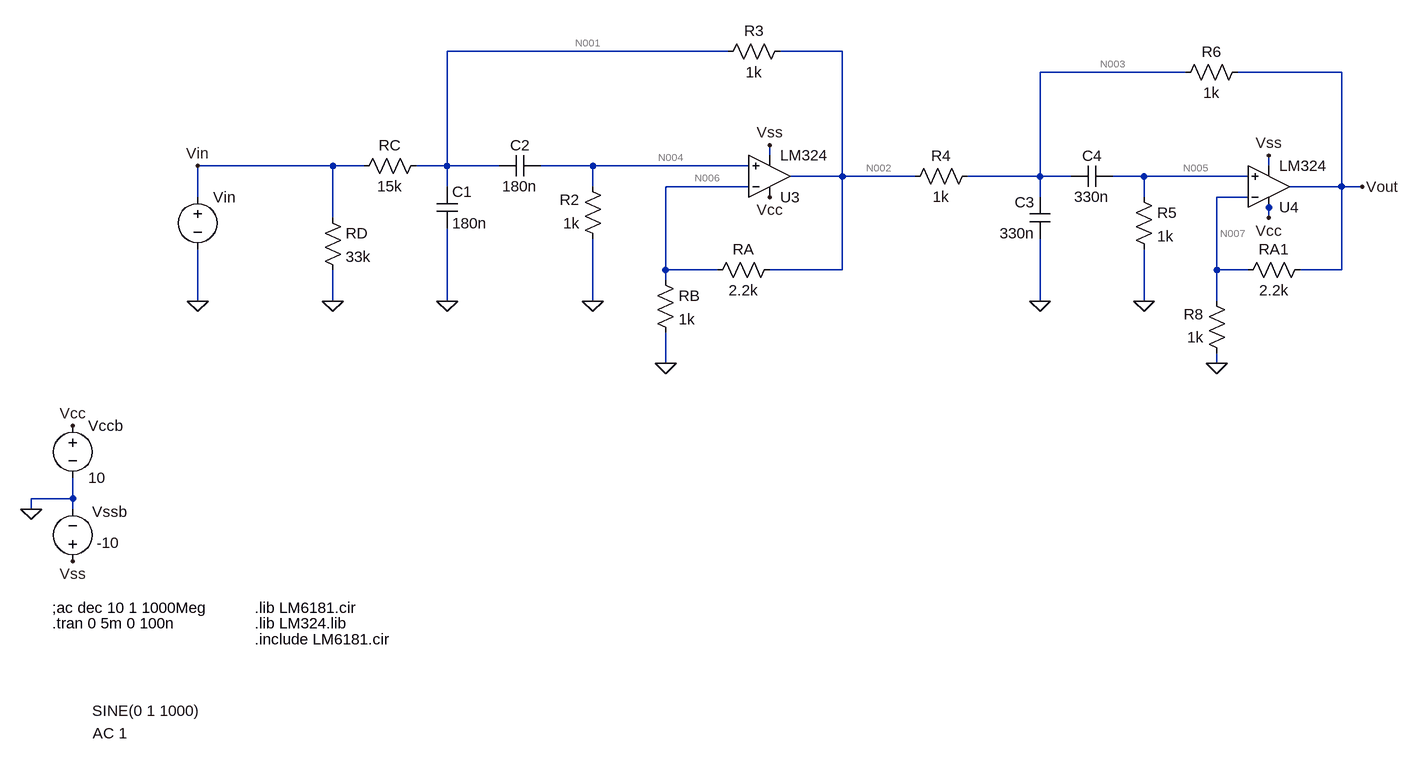
[diagram p0: schematic Lab4_Filtros Activos.asc]
Lab4_Filtros Activos.asc, the LTspice schematic file:
Version 4
SHEET 1 3612 1756
WIRE 352 -176 -80 -176
WIRE 528 -176 432 -176
WIRE 1056 -144 832 -144
WIRE 1296 -144 1136 -144
WIRE 416 -16 416 -32
WIRE -256 0 -464 0
WIRE -208 0 -256 0
WIRE -80 0 -80 -176
WIRE -80 0 -128 0
WIRE 0 0 -80 0
WIRE 144 0 64 0
WIRE 384 0 144 0
WIRE 1184 0 1184 -16
WIRE 528 16 528 -176
WIRE 528 16 448 16
WIRE 640 16 528 16
WIRE 832 16 832 -144
WIRE 832 16 720 16
WIRE 880 16 832 16
WIRE 992 16 944 16
WIRE 1152 16 992 16
WIRE -80 32 -80 0
WIRE 144 32 144 0
WIRE 384 32 256 32
WIRE 1296 32 1296 -144
WIRE 1296 32 1216 32
WIRE 1328 32 1296 32
WIRE -464 48 -464 0
WIRE 832 48 832 16
WIRE 992 48 992 16
WIRE 1152 48 1104 48
WIRE 1184 64 1184 48
WIRE -256 80 -256 0
WIRE 1184 80 1184 64
WIRE 256 160 256 32
WIRE 336 160 256 160
WIRE 528 160 528 16
WIRE 528 160 416 160
WIRE 1104 160 1104 48
WIRE 1152 160 1104 160
WIRE 1296 160 1296 32
WIRE 1296 160 1232 160
WIRE 256 176 256 160
WIRE -464 208 -464 128
WIRE -256 208 -256 160
WIRE -80 208 -80 96
WIRE 144 208 144 112
WIRE 832 208 832 112
WIRE 992 208 992 128
WIRE 1104 208 1104 160
WIRE 256 304 256 256
WIRE 1104 304 1104 288
WIRE -656 512 -656 480
WIRE -656 512 -720 512
WIRE -720 528 -720 512
WIRE -656 528 -656 512
FLAG 416 -32 Vss
FLAG 416 48 Vcc
FLAG -464 208 0
FLAG -720 528 0
FLAG -656 400 Vcc
FLAG -656 608 Vss
FLAG 1328 32 Vout
FLAG -464 0 Vin
FLAG 1184 -16 Vss
FLAG 1184 80 Vcc
FLAG -80 208 0
FLAG 144 208 0
FLAG 256 304 0
FLAG -256 208 0
FLAG 832 208 0
FLAG 1104 304 0
FLAG 992 208 0
SYMBOL voltage -464 32 R0
WINDOW 123 -161 841 Left 2
WINDOW 39 0 0 Left 0
WINDOW 3 -162 806 Left 2
SYMATTR Value2 AC 1
SYMATTR Value SINE(0 1 1000)
SYMATTR InstName Vin
SYMBOL voltage -656 384 R0
WINDOW 123 0 0 Left 0
WINDOW 39 0 0 Left 0
SYMATTR InstName Vccb
SYMATTR Value 10
SYMBOL voltage -656 624 R180
WINDOW 123 0 0 Left 0
WINDOW 39 0 0 Left 0
WINDOW 0 -83 92 Left 2
WINDOW 3 -72 44 Left 2
SYMATTR InstName Vssb
SYMATTR Value -10
SYMBOL OpAmps\\opamp2 416 80 M180
SYMATTR InstName U3
SYMATTR Value LM324
SYMBOL OpAmps\\opamp2 1184 96 M180
SYMATTR InstName U4
SYMATTR Value LM324
SYMBOL res -112 -16 R90
WINDOW 0 0 56 VBottom 2
WINDOW 3 32 56 VTop 2
SYMATTR InstName RC
SYMATTR Value 15k
SYMBOL res 160 128 R180
WINDOW 0 36 76 Left 2
WINDOW 3 36 40 Left 2
SYMATTR InstName R2
SYMATTR Value 1k
SYMBOL res 336 -160 R270
WINDOW 0 32 56 VTop 2
WINDOW 3 0 56 VBottom 2
SYMATTR InstName R3
SYMATTR Value 1k
SYMBOL res 736 0 R90
WINDOW 0 0 56 VBottom 2
WINDOW 3 32 56 VTop 2
SYMATTR InstName R4
SYMATTR Value 1k
SYMBOL res 976 32 R0
SYMATTR InstName R5
SYMATTR Value 1k
SYMBOL res 1152 -160 R90
WINDOW 0 0 56 VBottom 2
WINDOW 3 32 56 VTop 2
SYMATTR InstName R6
SYMATTR Value 1k
SYMBOL res 1248 144 R90
WINDOW 0 0 56 VBottom 2
WINDOW 3 32 56 VTop 2
SYMATTR InstName RA1
SYMATTR Value 2.2k
SYMBOL res 1120 304 R180
WINDOW 0 36 76 Left 2
WINDOW 3 36 40 Left 2
SYMATTR InstName R8
SYMATTR Value 1k
SYMBOL res 320 176 R270
WINDOW 0 32 56 VTop 2
WINDOW 3 0 56 VBottom 2
SYMATTR InstName RA
SYMATTR Value 2.2k
SYMBOL res 240 160 R0
SYMATTR InstName RB
SYMATTR Value 1k
SYMBOL cap -96 32 R0
SYMATTR InstName C1
SYMATTR Value 180n
SYMBOL cap 64 -16 R90
WINDOW 0 0 32 VBottom 2
WINDOW 3 32 32 VTop 2
SYMATTR InstName C2
SYMATTR Value 180n
SYMBOL cap 848 112 R180
WINDOW 0 24 56 Left 2
WINDOW 3 24 8 Left 2
SYMATTR InstName C3
SYMATTR Value 330n
SYMBOL cap 880 32 R270
WINDOW 0 32 32 VTop 2
WINDOW 3 0 32 VBottom 2
SYMATTR InstName C4
SYMATTR Value 330n
SYMBOL res -272 64 R0
SYMATTR InstName RD
SYMATTR Value 33k
TEXT -376 704 Left 2 !.lib LM324.lib
TEXT -688 680 Left 2 !;ac dec 10 1 1000Meg
TEXT -688 704 Left 2 !.tran 0 5m 0 100n
TEXT -376 680 Left 2 !.lib LM6181.cir
TEXT -376 728 Left 2 !.include LM6181.cir

The netlist it stands for:
* Lab4_Filtros Activos.asc
Vin Vin 0 SINE(0 1 1000) AC 1
Vccb Vcc 0 10
Vssb Vss 0 -10
XU3 N004 N006 Vcc Vss N002 LM324  ; pins In+ In- V+ V- OUT
XU4 N005 N007 Vcc Vss Vout LM324  ; pins In+ In- V+ V- OUT
RC N001 Vin 15k
R2 0 N004 1k
R3 N001 N002 1k
R4 N003 N002 1k
R5 N005 0 1k
R6 Vout N003 1k
RA1 Vout N007 2.2k
R8 0 N007 1k
RA N006 N002 2.2k
RB N006 0 1k
C1 N001 0 180n
C2 N004 N001 180n
C3 0 N003 330n
C4 N003 N005 330n
RD Vin 0 33k
.lib LM324.lib
;ac dec 10 1 1000Meg
.tran 0 5m 0 100n
.lib LM6181.cir
.include LM6181.cir
.backanno
.end

* Results of the author's LTspice run, read from the files saved beside the schematic
* Operating Point, zero values left out:
*   V(vcc) = 10 V
*   V(vss) = -10 V
*   V(n002) = -87.81 µV
*   V(n006) = -13.73 µV
*   V(n004) = 19.92 µV
*   V(vout) = -87.81 µV
*   V(n007) = -13.73 µV
*   V(n005) = 19.92 µV
*   V(n001) = -82.32 µV
*   V(n003) = -87.81 µV
*   I(Rc) = -5.488 nA
*   I(R2) = -19.92 nA
*   I(R3) = 5.488 nA
*   I(R5) = 19.92 nA
*   I(Ra1) = -33.67 nA
*   I(R8) = 13.73 nA
*   I(Ra) = 33.67 nA
*   I(Rb) = -13.73 nA
*   I(Vin) = -5.488 nA
*   I(Vccb) = -1.34 mA
*   I(Vssb) = 1.34 mA
*   Ix(u3:1) = -19.92 nA
*   Ix(u3:2) = -19.94 nA
*   Ix(u3:3) = 669.9 µA
*   Ix(u3:4) = -669.8 µA
*   Ix(u3:5) = 39.16 nA
*   Ix(u4:1) = -19.92 nA
*   Ix(u4:2) = -19.94 nA
*   Ix(u4:3) = 669.9 µA
*   Ix(u4:4) = -669.8 µA
*   Ix(u4:5) = 33.67 nA
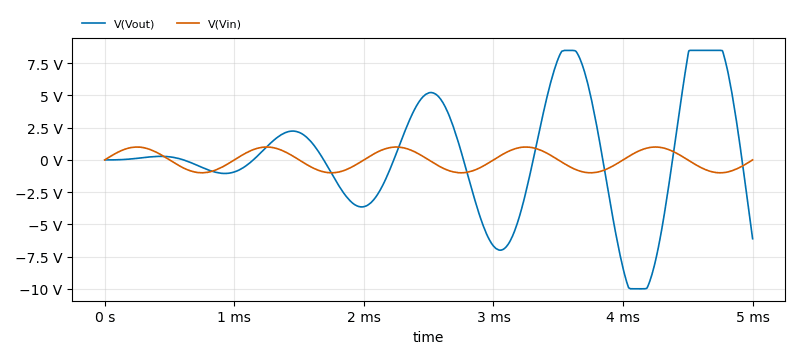
[diagram p1: Transient Analysis of Lab4_Filtros Activos.asc, plotted from the saved traces]
* Transient Analysis, 1 run:
*   V(Vout): min -9.996 V, max 8.495 V, average 247.5 mV, rms 4.559 V, last -6.112 V
*   V(Vin): min -1 V, max 1 V, average -5.414 µV, rms 706.8 mV, last 0 V